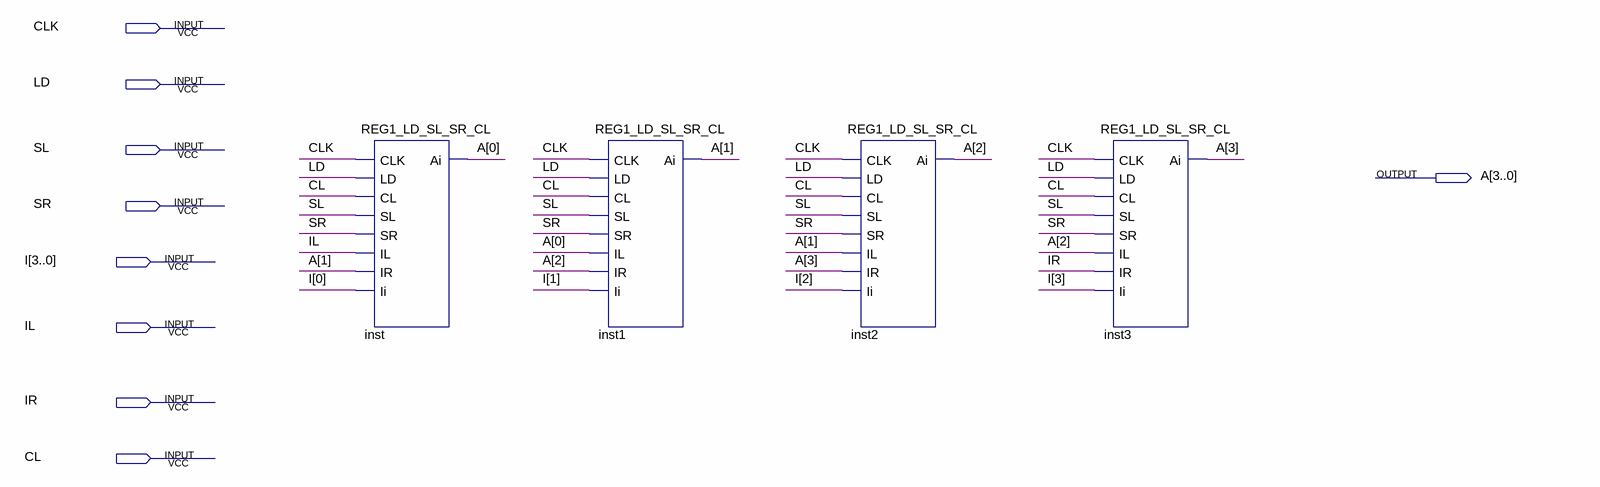
[diagram p0: schematic sheet]
// Quartus schematic REG4_LD_SL_SR_CL.bdf as structural Verilog: 4 symbols, 9 pins
module REG4_LD_SL_SR_CL (
  input  CLK,
  input  LD,
  input  SL,
  input  SR,
  input  [3:0] I,
  input  IL,
  input  IR,
  input  CL,
  output [3:0] A
);

  REG1_LD_SL_SR_CL inst (.CLK(CLK), .LD(LD), .CL(CL), .SL(SL), .SR(SR), .IL(IL), .IR(A[1]), .Ii(I[0]), .Ai(A[0]));
  REG1_LD_SL_SR_CL inst1 (.CLK(CLK), .LD(LD), .CL(CL), .SL(SL), .SR(SR), .IL(A[0]), .IR(A[2]), .Ii(I[1]), .Ai(A[1]));
  REG1_LD_SL_SR_CL inst2 (.CLK(CLK), .LD(LD), .CL(CL), .SL(SL), .SR(SR), .IL(A[1]), .IR(A[3]), .Ii(I[2]), .Ai(A[2]));
  REG1_LD_SL_SR_CL inst3 (.CLK(CLK), .LD(LD), .CL(CL), .SL(SL), .SR(SR), .IL(A[2]), .IR(IR), .Ii(I[3]), .Ai(A[3]));
endmodule
